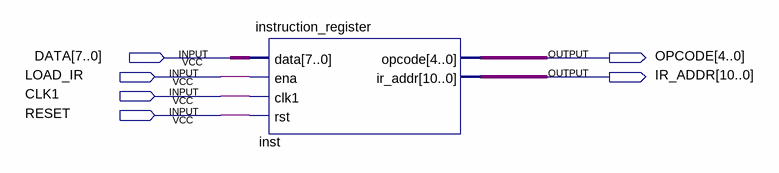
[diagram p0: schematic sheet]
// Quartus schematic instuction_register_bdf.bdf as structural Verilog: 1 symbols, 6 pins
module instuction_register_bdf (
  input  [7:0] DATA,
  input  LOAD_IR,
  input  CLK1,
  input  RESET,
  output [4:0] OPCODE,
  output [10:0] IR_ADDR
);

  instruction_register inst (.data(DATA), .ena(LOAD_IR), .clk1(CLK1), .rst(RESET), .opcode(OPCODE), .ir_addr(IR_ADDR));
endmodule
